# Altium schematic sheet Controller.SchDoc
size 431 x 279 mm; SheetNumber: 2; SheetTotal: 4; SheetTitle: Controller
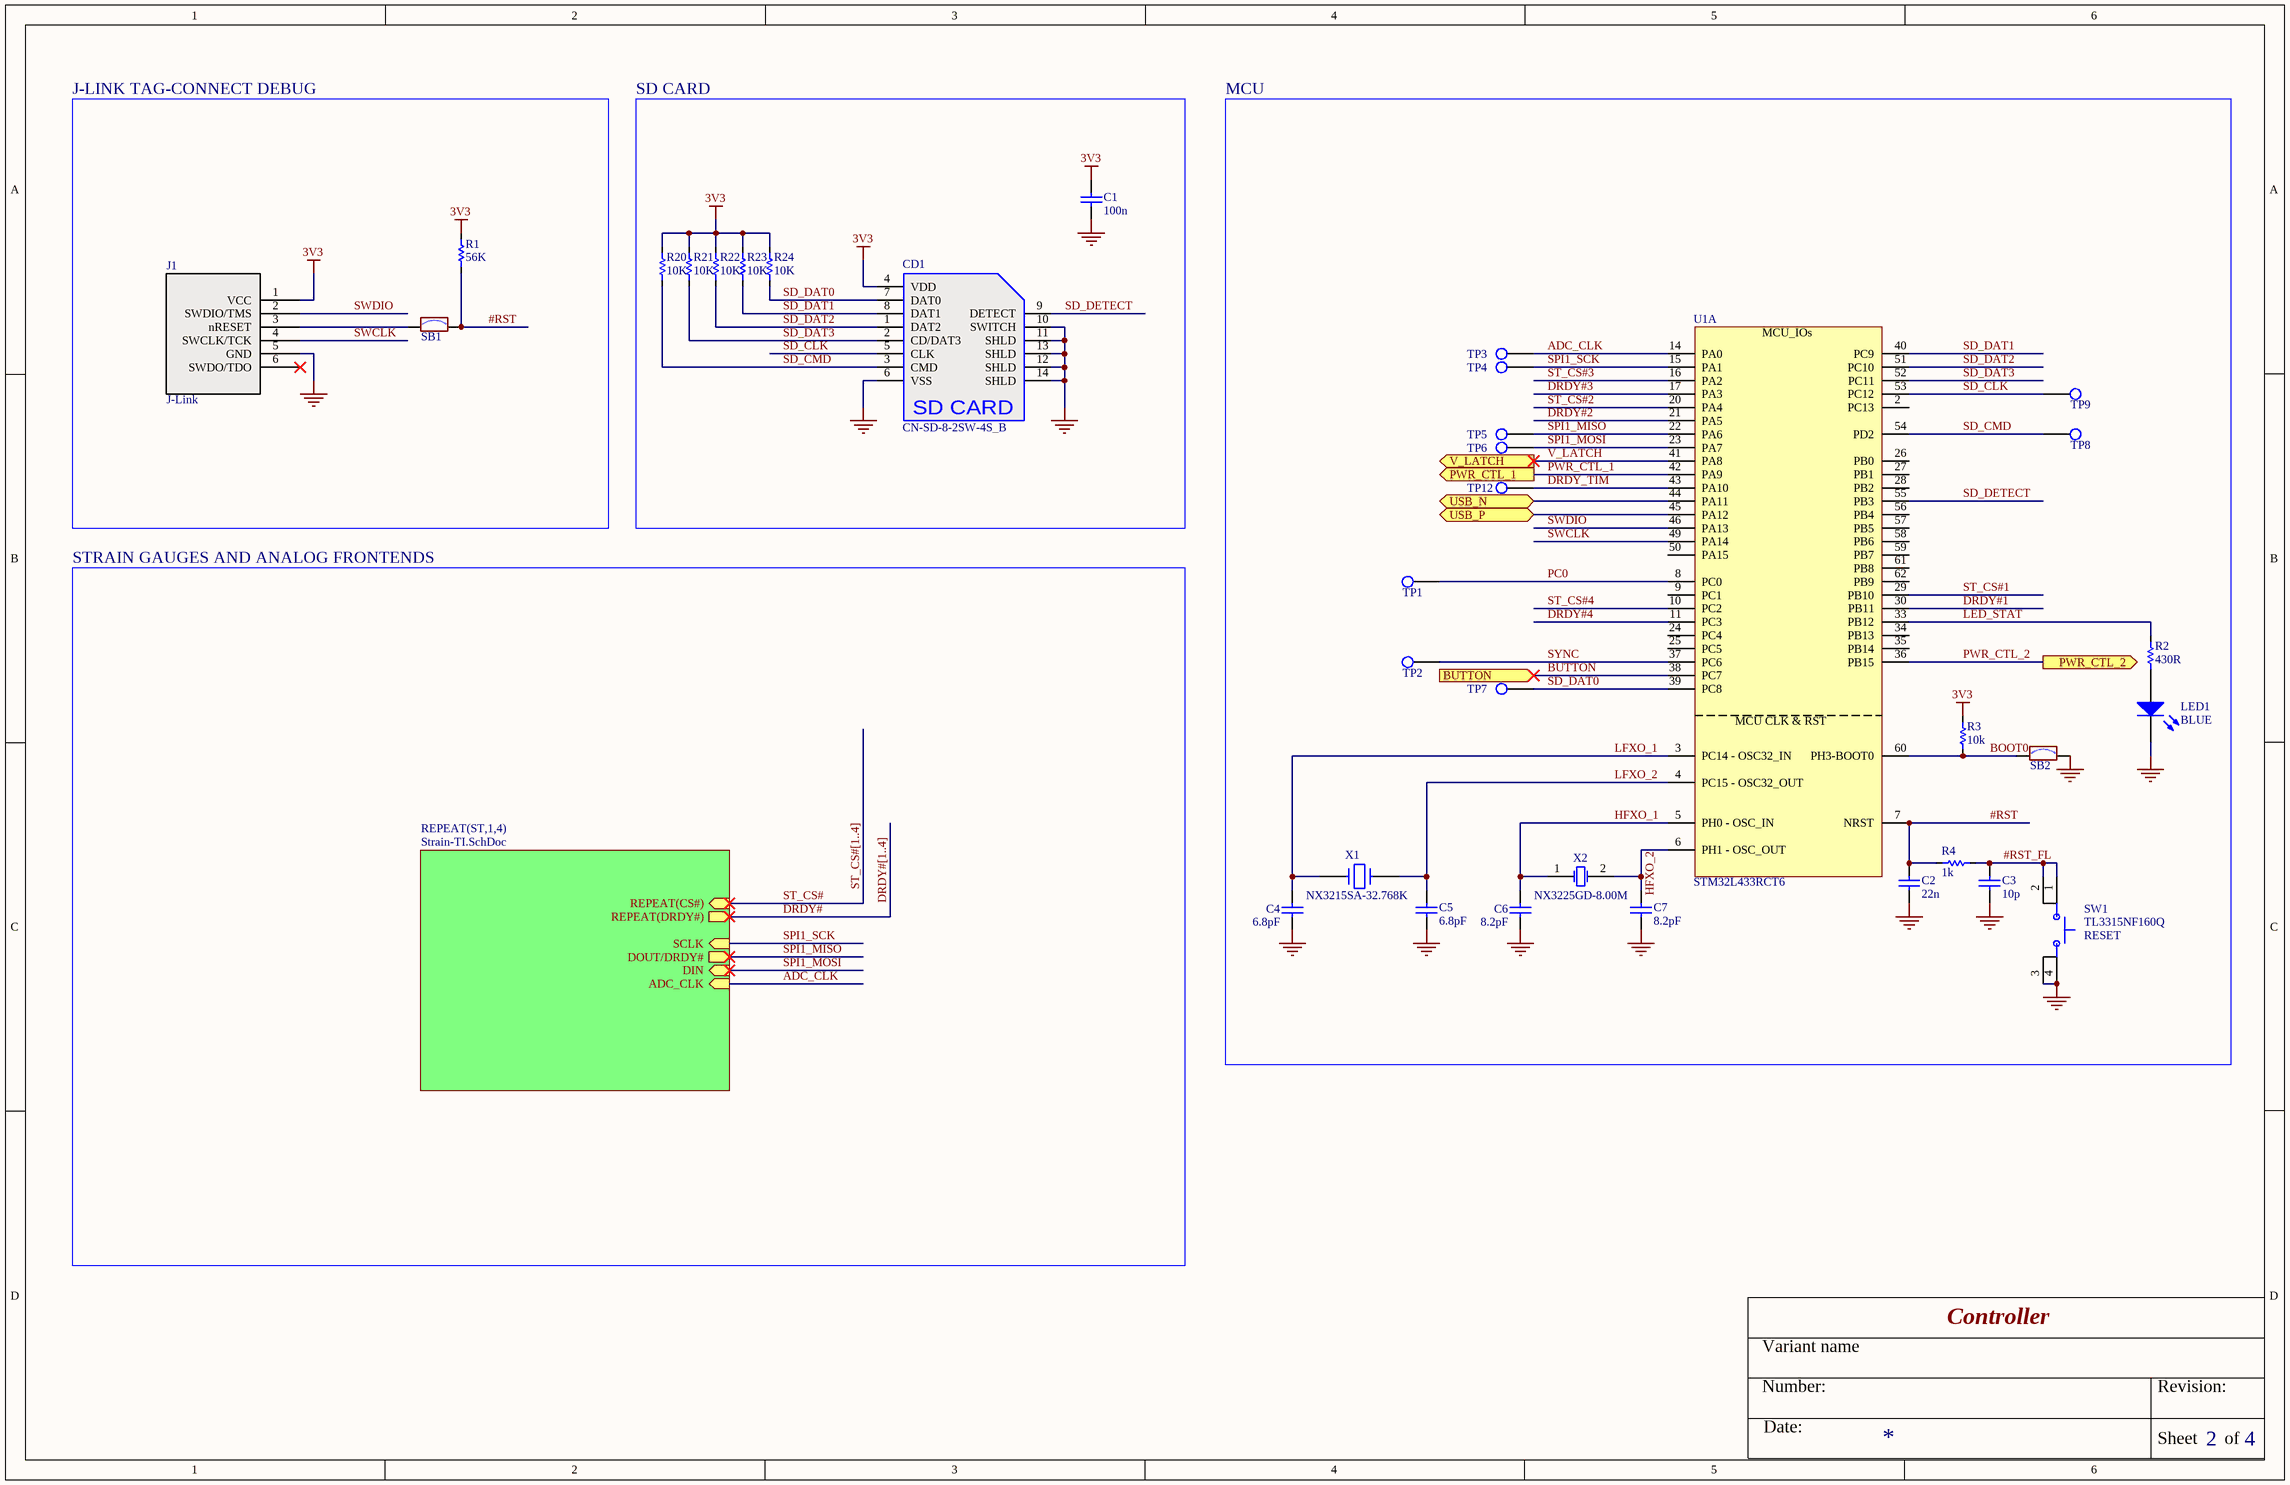
[diagram p0: Controller.SchDoc]

## Parts
C1  100n  [CAP_0603_M]
C2  22n  [CAP_0603_M]
C3  10p  [CAP_0603_M]
C4  value 6.8pF  [CAP_0402_M]  (hidden comment: Capacitor)
C5  value 6.8pF  [CAP_0402_M]  (hidden comment: Capacitor)
C6  value 8.2pF  [CAP_0402_M]  (hidden comment: Capacitor)
C7  value 8.2pF  [CAP_0402_M]  (hidden comment: Capacitor)
CD1  CN-SD-8-2SW-4S_B  [MOLX-502774-0891_V]
J1  J-Link  [TC2030-MCP-NL_R2]  (no BOM)
LED1  BLUE  [0603_A]
R1  56K  [RES_0603_M]
R2  430R  [RES_0603_M]
R3  10k  [RES_0603_M]
R4  1k  [RES_0603_M]
R20  10K  [RES_0402]
R21  10K  [RES_0402]
R22  10K  [RES_0402]
R23  10K  [RES_0402]
R24  10K  [RES_0402]
SB1  SB_ON  [SOLDER-BRIDGE_R0603-0R]  (value not drawn)  (no BOM)
SB2  SB_ON  [SOLDER-BRIDGE_R0603-0R]  (value not drawn)  (no BOM)
SW1  TL3315NF160Q  [E-Switch_TL3315NF160Q]
TP1  TP-1.5mm  [TP-1.5mm]  (value not drawn)
TP2  TP-1.5mm  [TP-1.5mm]  (value not drawn)
TP3  TP-1.5mm  [TP-1.5mm]  (value not drawn)
TP4  TP-1.5mm  [TP-1.5mm]  (value not drawn)
TP5  TP-1.5mm  [TP-1.5mm]  (value not drawn)
TP6  TP-1.5mm  [TP-1.5mm]  (value not drawn)
TP7  TP-1.5mm  [TP-1.5mm]  (value not drawn)
TP8  TP-1.5mm  [TP-1.5mm]  (value not drawn)
TP9  TP-1.5mm  [TP-1.5mm]  (value not drawn)
TP12  TP-1.5mm  [TP-1.5mm]  (value not drawn)
U1  STM32L433RCT6  [ICC_LQFP64_10X10_P050]  (part A of 2)
X1  value NX3215SA-32.768K  [CRY_NX3215SA_2P]  (hidden comment: XTAL_32K_NX3215SA)
X2  value NX3225GD-8.00M  [CRY_NX3225GD_2P]  (hidden comment: XTAL_8M_NX3225GD)

## Blocks framed on the sheet
J-LINK TAG-CONNECT DEBUG: J1 R1 SB1
SD CARD: C1 CD1 R20-R24
MCU: C2-C7 LED1 R2-R4 SB2 SW1 TP1-TP9 TP12 U1 X1 X2

## Sub-sheets
REPEAT(ST,1,4) = Strain-TI.SchDoc: REPEAT(CS#) (in), SCLK (in), DIN (in), DOUT/DRDY# (out), REPEAT(DRDY#) (out), ADC_CLK (in)

## Ports
BUTTON (in), PWR_CTL_1 (out), PWR_CTL_2 (out), USB_N (bidir), USB_P (bidir), V_LATCH (out)

## Nets
3V3: C1.2 CD1.4(VDD) J1.1(VCC) R1.2 R3.2 R20.2 R21.2 R22.2 R23.2 R24.2
GND: C1.1 C2.1 C3.1 C4.2 C5.2 C6.1 C7.1 CD1.6(VSS) CD1.10(SWITCH) CD1.11(SHLD) CD1.12(SHLD) CD1.13(SHLD) CD1.14(SHLD) J1.5(GND) LED1.1(K) SB2.2 SW1.3 SW1.4
#RST: C2.2 R1.1 R4.2 SB1.2 U1.7(NRST)
#RST_FL: C3.2 R4.1 SW1.1 SW1.2
ADC_CLK: TP3.1 U1.14(PA0) ; sheet REPEAT(ST,1,4)/ADC_CLK
BOOT0: R3.1 SB2.1 U1.60(PH3-BOOT0)
BUTTON: U1.38(PC7) ; port BUTTON
DRDY#: sheet REPEAT(ST,1,4)/REPEAT(DRDY#)
DRDY#1: U1.30(PB11)
DRDY#2: U1.21(PA5)
DRDY#3: U1.17(PA3)
DRDY#4: U1.11(PC3)
DRDY_TIM: TP12.1 U1.43(PA10)
HFXO_1: C6.2 U1.5(PH0_-_OSC_IN) X2.1(OSC1)
HFXO_2: C7.2 U1.6(PH1_-_OSC_OUT) X2.2(OSC2)
LED_STAT: R2.2 U1.33(PB12)
LFXO_1: C4.1 U1.3(PC14_-_OSC32_IN) X1.1
LFXO_2: C5.1 U1.4(PC15_-_OSC32_OUT) X1.2
PC0: TP1.1 U1.8(PC0)
PWR_CTL_1: U1.42(PA9) ; port PWR_CTL_1
PWR_CTL_2: U1.36(PB15) ; port PWR_CTL_2
SD_CLK: CD1.5(CLK) TP9.1 U1.53(PC12)
SD_CMD: CD1.3(CMD) R20.1 TP8.1 U1.54(PD2)
SD_DAT0: CD1.7(DAT0) R24.1 TP7.1 U1.39(PC8)
SD_DAT1: CD1.8(DAT1) R23.1 U1.40(PC9)
SD_DAT2: CD1.1(DAT2) R22.1 U1.51(PC10)
SD_DAT3: CD1.2(CD/DAT3) R21.1 U1.52(PC11)
SD_DETECT: CD1.9(DETECT) U1.55(PB3)
SPI1_MISO: TP5.1 U1.22(PA6) ; sheet REPEAT(ST,1,4)/DOUT/DRDY#
SPI1_MOSI: TP6.1 U1.23(PA7) ; sheet REPEAT(ST,1,4)/DIN
SPI1_SCK: TP4.1 U1.15(PA1) ; sheet REPEAT(ST,1,4)/SCLK
ST_CS#: sheet REPEAT(ST,1,4)/REPEAT(CS#)
ST_CS#1: U1.29(PB10)
ST_CS#2: U1.20(PA4)
ST_CS#3: U1.16(PA2)
ST_CS#4: U1.10(PC2)
SWCLK: J1.4(SWCLK/TCK) U1.49(PA14)
SWDIO: J1.2(SWDIO/TMS) U1.46(PA13)
SYNC: TP2.1 U1.37(PC6)
USB_N: U1.44(PA11) ; port USB_N
USB_P: U1.45(PA12) ; port USB_P
V_LATCH: U1.41(PA8) ; port V_LATCH
NetJ1_3: J1.3(nRESET) SB1.1
NetLED1_2: LED1.2(A) R2.1

Not connected (* = marked no-connect by the designer): J1 6(SWDO/TDO)*; U1 2(PC13) 9(PC1) 24(PC4) 25(PC5) 26(PB0) 27(PB1) 28(PB2) 34(PB13) 35(PB14) 50(PA15) 56(PB4) 57(PB5) 58(PB6) 59(PB7) 61(PB8) 62(PB9)

## Buses and harness runs
bus DRDY#[1..4]
bus ST_CS#[1..4]

## Notes on the sheet
- STRAIN GAUGES AND ANALOG FRONTENDS
- (near SW1) RESET
- Variant name
- Number:
- Date:
- Revision:
- Sheet
- of
- (in symbol MOLEX_CN-SD-8-2SW-4S_B) SD CARD
- (in symbol STM32L433RCT6, part A) MCU_IOs; MCU CLK & RST

## Library data of the parts
C1 = CAP_0603: CAP 100nF 6.3V 20% X7R 0603; Category: capacitor; Created: 2018-07-01; Created By: JS; Last Modified: 2018-07-01
C2 = CAP_0603: CAP 22nF 6.3V 20% X7R 0603; Category: capacitor; Created: 2018-07-01; Created By: JS; Last Modified: 2018-07-01
C3 = CAP_0603: CAP 10pF 6.3V 20% NP0 0603; Category: capacitor; Created: 2018-07-01; Created By: JS; Last Modified: 2018-07-01
C4 C5 = MCD-00674: CAP 6.8pF 25V 4% NP0 0402; Manufacturer_Part_Number: CC0402CRNPO9BN6R8; Manufacturer: YAGEO; Provided_By: Subcon; Initial_Board_Reference: mb1319; Internal_Part_Number: MCD-00674; Status: Released; Part_Type: Capacitor; Package: C0402; ComponentLink1Description: Yageo_Capacitor_NP0_16V-to-50V.pdf; ComponentLink1URL: http://tunmcdsvn.tun.st.com/Component_Datasheet_Library/Trunk/Capacitors/Yageo_Capacitor_NP0_16V-to-50V.pdf; ECCN_US: n/a; ECCN_EU: n/a
C6 C7 = MCD-00004: CAP 8.2pF 25V 4% NP0 0402; Manufacturer_Part_Number: 04025A8R2CAT2A; Manufacturer: AVX; Provided_By: Subcon; Initial_Board_Reference: mb1274; Internal_Part_Number: MCD-00004; ComponentLink1Description: AVX_Capacitor_C0G-NP0-series.pdf; ECCN_US: n/a; ECCN_EU: n/a; Status: Released; Part_Type: Capacitor; Package: 0402
CD1 = MOLEX_CN-SD-8-2SW-4S_B: Micro SD Card Slot; Manufacturer PN: 502774-0891_V; Manufacturer: Molex
J1 = TC2030-CTX-NL
LED1 = CMP-1426-00005-1: SMD LED Blue 0603; PartNumber: 150060YS75000; Manufacturer: Wuerth Elektronik; Color: Yellow; ComponentLink1URL: http://www.we-online.com; ComponentLink2Description: Datasheet; ComponentLink2URL: http://katalog.we-online.com/led/datasheet/150060YS75000.pdf; ComponentLink1Description: Manufacturer URL; PackageReference: 0603_A
R1 = RES_0603: RES 56K 1/5W 0603; Manufacturer: *; Manufacturer PN: *; Category: resistor; Created: 2018-07-01; Last Modified: 2018-07-01; Created By: JS
R2 = RES_0603: RES 430R 1/5W 0603; Manufacturer: *; Manufacturer PN: *; Category: resistor; Created: 2018-07-01; Last Modified: 2018-07-01; Created By: JS
R3 = RES_0603: RES 10K 1/5W 0603; Manufacturer: *; Manufacturer PN: *; Category: resistor; Created: 2018-07-01; Last Modified: 2018-07-01; Created By: JS
R4 = RES_0603: RES 1K 1/5W 0603; Manufacturer: *; Manufacturer PN: *; Category: resistor; Created: 2018-07-01; Last Modified: 2018-07-01; Created By: JS
R20-R24 = RES_0402: RES 10K 1/5W 0402; Manufacturer: *; Manufacturer PN: *; Category: resistor; Created: 2018-09-12; Last Modified: 2018-09-12; Created By: JS
SB1 SB2 = SB_ON: Solder Bridge ON; Internal_Part_Number: MCD-00071; Part_Type: Mechanical; Provided_By: Subcon; Initial_Board_Reference: mb1274; ECCN_US: n/a; ECCN_EU: n/a; Status: Released
SW1 = E-SWITCH_TL3315NF160Q: SWITCH TACTILE SPST-NO 0.05A 15V
TP1 = TP-1.5mm: Test Point; PCB_Label: PC0
TP2 = TP-1.5mm: Test Point; PCB_Label: SYNC
TP3-TP9 TP12 = TP-1.5mm: Test Point; PCB_Label: ADC_CLK
U1 = STM32L433RCT6: Microcontroller 256_STM32L433 . LQFP64 package; Internal_Part_Number: MCD-00548; Part_Type: IC; Manufacturer: STMICROELECTRONICS; ECCN_US: 3A991A2; ECCN_EU: NEC; Provided_By: STM; Initial_Board_Reference: mb1319; Status: Symbol available; Manufacturer_Part_Number: STM32L433RCT6; Value: STM32L433RCT6
X1 = XTAL_32K_NX3215SA: Crystal 32.768kHz, 6pF, -+20PPM, R=50K, SMD; Internal_Part_Number: MCD-00091; Manufacturer_Part_Number: NX3215SA 32.768KHz EXS00A-MU00525; Manufacturer: NDK; Part_Type: Crystal_Osc; ECCN_US: EAR99; ECCN_EU: NEC; Provided_By: STM; Initial_Board_Reference: mb1274; ComponentLink1Description: NDK_Crystal-For-ST_NX3215SA 32.768KHz EXS00A-MU00525 (EXS10B-21238).pdf; Status: Released
X2 = XTAL_8M_NX3225GD: Crystal 8Mhz, 8pF, -+50PPM, SMD; Internal_Part_Number: MCD-00092; Manufacturer_Part_Number: NX3225GD 8MHz EXS00A-CG04874; Manufacturer: NDK; Part_Type: Crystal_Osc; ECCN_US: EAR99; ECCN_EU: NEC; Provided_By: STM; Initial_Board_Reference: mb1274; ComponentLink1Description: NDK_Crystal-For-ST_NX3225GD 8MHz EXS00A-CG04874 (EXS10B-20725).pdf; Status: Released